# EAGLE design I2c DAC (EAGLE 6.2)
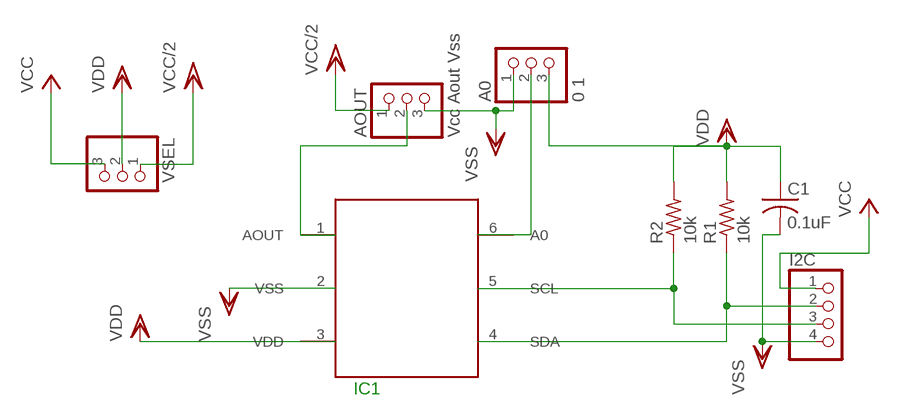
[diagram p0: schematic, sheet 1]

## Parts
A0  0 1  PINHD-1X3  [1X03]
AOUT  Vcc Aout Vss  PINHD-1X3  [1X03]
C1  0.1uF  C-USC0402  [C0402]
I2C  PINHD-1X4  [1X04]
IC1  MCP4725  [SOT23-6]
R1  10k  R-US_R0402  [R0402]
R2  10k  R-US_R0402  [R0402]
VSEL  PINHD-1X3  [1X03]

## Nets
N$1: A0.2 IC1.6(A0)
N$2: I2C.3 IC1.5(SCL) R2.1
N$3: I2C.2 IC1.4(SDA) R1.1
N$4: AOUT.2 IC1.1(AOUT)
VCC: I2C.1 VSEL.3
VCC/2: AOUT.1 VSEL.1
VDD: A0.3 C1.1 IC1.3(VDD) R1.2 R2.2 VSEL.2
VSS: A0.1 AOUT.3 C1.2 I2C.4 IC1.2(VSS)

## Notes on the sheet
- IC1

## Library data of the parts
A0 AOUT VSEL = pinhead:PINHD-1X3: PIN HEADER
C1 = resistor:C-US: CAPACITOR, American symbol
I2C = pinhead:PINHD-1X4: PIN HEADER
IC1 = zetex:MCP4725
R1 R2 = resistor:R-US_: RESISTOR, American symbol

## Board
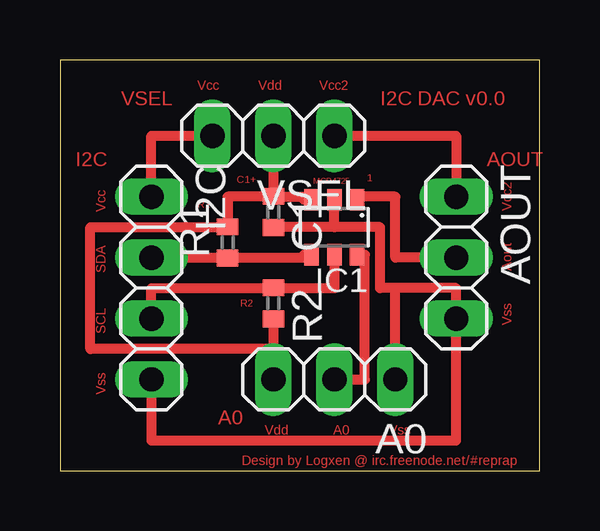
[diagram p1: board, top side]

Size 19.99 x 17.14 mm. Coordinates in mm from the lower left corner, seen from the top.
Outline: 0,0 19.99,0 19.99,17.14 0,17.14 0,0
Copper layers 1: Top 0.035mm
Design rules: minimum track width 10mil, minimum drill 24mil, track to track 8mil, track to pad 8mil, pad to pad 8mil, via to via 8mil, smd to smd 8mil, copper to edge 40mil, drill to drill 8mil, minimum pad ring 10mil, minimum via ring 8mil, stop-mask expansion 4mil, vias tented up to drill 0mil, thermal gap 10mil

### Footprints (pad centres in the part's own frame; a part is rotated, then mirrored left to right if it is on the bottom)
1X03 = drill 1.016 long: 1 -2.54,0; 2 0,0; 3 2.54,0
C0402 = smd 0.7 x 0.9: 1 -0.65,0; 2 0.65,0
1X04 = drill 1.016 long: 1 -3.81,0; 2 -1.27,0; 3 1.27,0; 4 3.81,0
SOT23-6 = smd 0.6 x 0.9: 1 -0.95,-1.15; 2 0,-1.15; 3 0.95,-1.15; 4 0.95,1.15; 5 0,1.15; 6 -0.95,1.15
R0402 = smd 0.7 x 0.9: 1 -0.65,0; 2 0.65,0

### Placement (x,y rotation side)
A0  11.43,3.81 180 top
AOUT  16.51,8.89 270 top
C1  8.89,10.79 270 top
I2C  3.81,7.62 270 top
IC1  11.43,10.16 180 top
R1  6.99,9.53 90 top
R2  8.89,6.99 270 top
VSEL  8.89,13.97 180 top

### Tracks (layer width: path | path; a pad name or v marks a point on that pad's centre or on a via)
N$1
  Top 0.406: A0.2 12.7,3.81 12.7,9.01 IC1.6
N$2
  Top 0.406: I2C.3 3.81,7.62 8.89,7.62 | 8.89,7.62 11.43,7.62 IC1.5 | R2.1 8.89,7.62
N$3
  Top 0.406: I2C.2 R1.1 | R1.1 10.16,8.89 10.16,9.01 IC1.4 | R1.1
N$4
  Top 0.406: AOUT.2 13.97,8.89 13.97,11.43 12.38,11.43 IC1.1
VCC
  Top 0.406: I2C.1 3.81,13.97 VSEL.3
VCC/2
  Top 0.406: VSEL.1 16.51,13.97 AOUT.1
VDD
  Top 0.406: VSEL.2 C1.1 8.89,11.43 | 8.89,11.43 10.16,11.43 10.16,11.31 IC1.3 | R2.2 8.89,5.08 | 8.89,5.08 1.27,5.08 1.27,10.16 6.35,10.16 R1.2 6.99,11.43 8.89,11.43 | A0.3 8.89,5.08
VSS
  Top 0.406: 11.43,10.16 IC1.2 | 13.97,7.62 16.51,7.62 AOUT.3 16.51,1.27 3.81,1.27 I2C.4 | 13.97,7.62 13.34,7.62 13.34,10.16 11.43,10.16 | A0.1 13.97,7.62 | 11.43,10.16 8.89,10.16 C1.2

### Text on the board
Top: Vcc | Vdd | Vcc2 | VSEL | I2C DAC v0.0 | I2C | AOUT | C1+ | MCP4725 | 1 | Vcc2 | Vcc | R1 | Aout | SDA | R2 | Vss | SCL | Vss | A0 | Vdd | A0 | Vss | Design by Logxen @ irc.freenode.net/#reprap